# Altium schematic sheet Peripherals.schdoc
size 197 x 109 mm
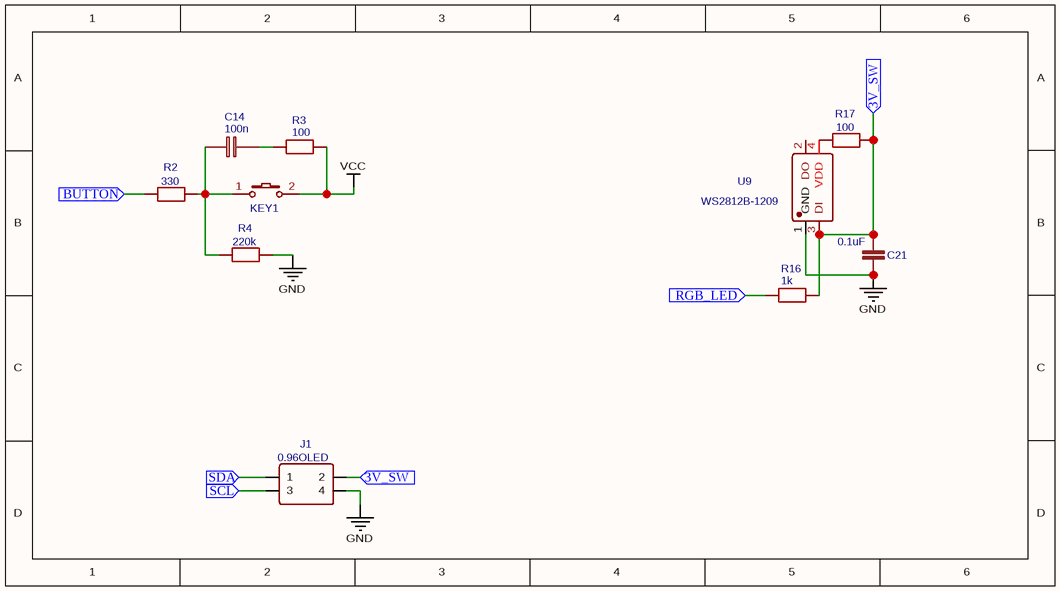
[diagram p0: Peripherals.schdoc]

## Parts
C14  100n  [C0603]
C21  0.1uF  [0603-CAP]
J1  0.96OLED  [HDR-M-2.54_2X2]
KEY1  K2-3.6×6.1_SMD  [KEY-SMD_2P-L6.2-W3.6-LS8.0]  (value not drawn)
R2  330  [R0603]
R3  100  [R0603]
R4  220k  [R0603]
R16  1k  [R0603]
R17  100  [R0603]
U9  WS2812B-1209  [LED-SMD_4P-L3.2-W2.7-TL-WS2812B-1209]

## Ports
3V_SW (in), BUTTON (in), RGB_LED (in), SCL (in), SDA (in)

## Nets
GND: C21.2 J1.4 R4.2 U9.1(GND)
VCC: KEY1.2 R3.2
3V_SW: C21.1 J1.2 R16.1 R17.2 U9.3(DI) ; port 3V_SW
BUTTON: R2.1 ; port BUTTON
RGB_LED: R16.2 ; port RGB_LED
SCL: J1.3 ; port SCL
SDA: J1.1 ; port SDA
NetC14_1: C14.1 KEY1.1 R2.2 R4.1
NetC14_2: C14.2 R3.1
NetR17_1: R17.1 U9.4(VDD)

Not connected (* = marked no-connect by the designer): U9 2(DO)

## Library data of the parts
C14 = 100n: nameAlias: Value(F); Contributor: LCEDA_Lib; spicePre: C; spiceSymbolName: C_0603_EU
C21 = 0.1uF: description: CAP-00810; Contributor: SparkFun; spicePre: C; spiceSymbolName: 0.1UF-25V(+80_-20%)(0603)
J1 = 0.96OLED: Contributor: LCEDA_Lib; BOM_Supplier Part: C66690; BOM_Supplier: LCSC; spicePre: J; spiceSymbolName: HDR-M-2.54_2x2
KEY1 = K2-3.6×6.1_SMD: BOM_Manufacturer Part: K2-1107ST-A4SW-06; Contributor: LCEDA_Lib; 制造商: 韩国韩荣; BOM_Supplier Part: C118141; BOM_Supplier: LCSC; spicePre: K; spiceSymbolName: K2-3.6×6.1_SMD
R2 = 330: nameAlias: Value(Ω); Contributor: LCEDA_Lib; spicePre: R; spiceSymbolName: R_0603_EU
R3 = 100: nameAlias: Value(Ω); Contributor: LCEDA_Lib; spicePre: R; spiceSymbolName: R_0603_EU
R4 = 220k: nameAlias: Value(Ω); Contributor: LCEDA_Lib; spicePre: R; spiceSymbolName: R_0603_EU
R16 = 1k: BOM_Manufacturer: Resistor.Today; BOM_Manufacturer Part: TCTR0603F47K0F3960T; Contributor: LCSC; BOM_Supplier: LCSC; BOM_Supplier Part: C525388; BOM_JLCPCB Part Class: Extended Part; spicePre: R; spiceSymbolName: TCTR0603F47K0F3960T
R17 = 100: BOM_Manufacturer: Resistor.Today; BOM_Manufacturer Part: TCTR0603F47K0F3960T; Contributor: LCSC; BOM_Supplier: LCSC; BOM_Supplier Part: C525388; BOM_JLCPCB Part Class: Extended Part; spicePre: R; spiceSymbolName: TCTR0603F47K0F3960T
U9 = WS2812B-1209: BOM_Manufacturer: null; Contributor: LCSC; BOM_Supplier: LCSC; BOM_Supplier Part: C2835111; BOM_Manufacturer Part: WS2812B-1209; BOM_JLCPCB Part Class: Extended Part; spicePre: U; spiceSymbolName: WS2812B-1209